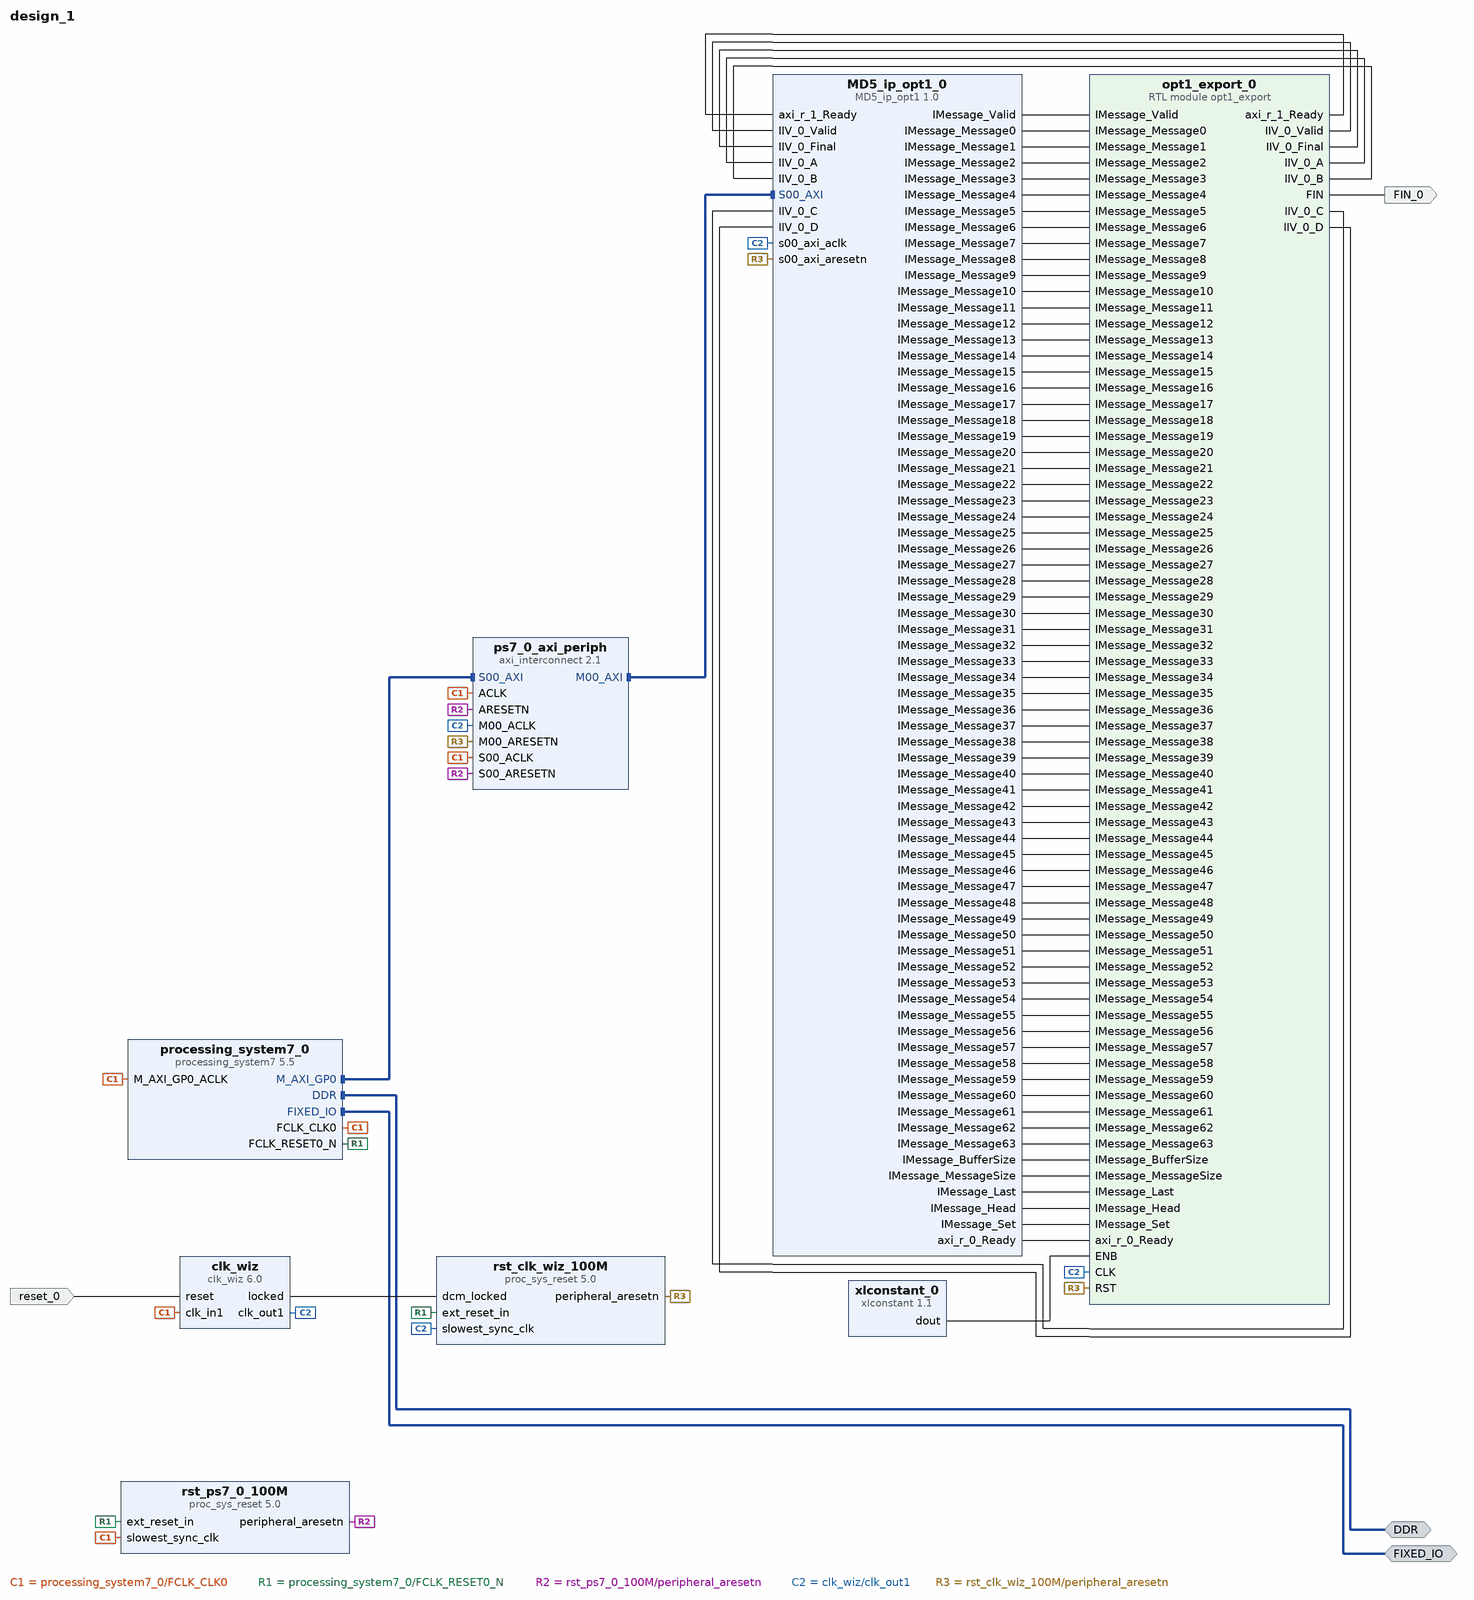
[diagram p0: block diagram of the top level]
# Vivado block design design_1, xc7z020clg484-1, Vivado 2020.2
create_bd_design design_1

create_bd_intf_port -mode Master -vlnv xilinx.com:interface:ddrx_rtl:1.0 DDR
create_bd_intf_port -mode Master -vlnv xilinx.com:display_processing_system7:fixedio_rtl:1.0 FIXED_IO
create_bd_port -dir O FIN_0
create_bd_port -dir I -type rst reset_0
set_property -dict {CONFIG.POLARITY ACTIVE_HIGH} [get_bd_ports reset_0]

create_bd_cell -type ip -vlnv user.org:user:MD5_ip_opt1:1.0 MD5_ip_opt1_0
create_bd_cell -type module -reference opt1_export opt1_export_0
create_bd_cell -type ip -vlnv xilinx.com:ip:xlconstant:1.1 xlconstant_0
create_bd_cell -type ip -vlnv xilinx.com:ip:processing_system7:5.5 processing_system7_0
set_property -dict [list \
  CONFIG.PCW_APU_PERIPHERAL_FREQMHZ 666.666667 \
  CONFIG.PCW_ENET0_ENET0_IO {MIO 16 .. 27} \
  CONFIG.PCW_ENET0_GRP_MDIO_ENABLE 1 \
  CONFIG.PCW_ENET0_GRP_MDIO_IO {MIO 52 .. 53} \
  CONFIG.PCW_ENET0_PERIPHERAL_ENABLE 1 \
  CONFIG.PCW_ENET0_RESET_ENABLE 0 \
  CONFIG.PCW_ENET_RESET_ENABLE 1 \
  CONFIG.PCW_ENET_RESET_SELECT {Share reset pin} \
  CONFIG.PCW_FPGA0_PERIPHERAL_FREQMHZ 100.000000 \
  CONFIG.PCW_FPGA1_PERIPHERAL_FREQMHZ 150.000000 \
  CONFIG.PCW_FPGA2_PERIPHERAL_FREQMHZ 50.000000 \
  CONFIG.PCW_GPIO_MIO_GPIO_ENABLE 1 \
  CONFIG.PCW_GPIO_MIO_GPIO_IO MIO \
  CONFIG.PCW_I2C_RESET_ENABLE 1 \
  CONFIG.PCW_PRESET_BANK1_VOLTAGE {LVCMOS 1.8V} \
  CONFIG.PCW_QSPI_GRP_SINGLE_SS_ENABLE 1 \
  CONFIG.PCW_QSPI_GRP_SINGLE_SS_IO {MIO 1 .. 6} \
  CONFIG.PCW_QSPI_PERIPHERAL_ENABLE 1 \
  CONFIG.PCW_QSPI_PERIPHERAL_FREQMHZ 200.000000 \
  CONFIG.PCW_QSPI_QSPI_IO {MIO 1 .. 6} \
  CONFIG.PCW_SD0_GRP_CD_ENABLE 1 \
  CONFIG.PCW_SD0_GRP_CD_IO {MIO 47} \
  CONFIG.PCW_SD0_GRP_WP_ENABLE 1 \
  CONFIG.PCW_SD0_GRP_WP_IO {MIO 46} \
  CONFIG.PCW_SD0_PERIPHERAL_ENABLE 1 \
  CONFIG.PCW_SD0_SD0_IO {MIO 40 .. 45} \
  CONFIG.PCW_SDIO_PERIPHERAL_FREQMHZ 50 \
  CONFIG.PCW_SINGLE_QSPI_DATA_MODE x4 \
  CONFIG.PCW_TTC0_PERIPHERAL_ENABLE 1 \
  CONFIG.PCW_TTC0_TTC0_IO EMIO \
  CONFIG.PCW_UART1_PERIPHERAL_ENABLE 1 \
  CONFIG.PCW_UART1_UART1_IO {MIO 48 .. 49} \
  CONFIG.PCW_UART_PERIPHERAL_FREQMHZ 50 \
  CONFIG.PCW_UIPARAM_DDR_FREQ_MHZ 533.333313 \
  CONFIG.PCW_UIPARAM_DDR_PARTNO {MT41J128M16 HA-15E} \
  CONFIG.PCW_USB0_PERIPHERAL_ENABLE 1 \
  CONFIG.PCW_USB0_RESET_ENABLE 0 \
  CONFIG.PCW_USB0_USB0_IO {MIO 28 .. 39} \
  CONFIG.PCW_USB_RESET_ENABLE 1 \
  CONFIG.PCW_USB_RESET_SELECT {Share reset pin} \
  CONFIG.preset ZedBoard \
] [get_bd_cells processing_system7_0]
# 221 more settings of processing_system7_0 are not shown: defaults, MIO pin electricals, DDR timing, and values the tool derives
create_bd_cell -type ip -vlnv xilinx.com:ip:axi_interconnect:2.1 ps7_0_axi_periph
set_property -dict {CONFIG.NUM_MI 1} [get_bd_cells ps7_0_axi_periph]
create_bd_cell -type ip -vlnv xilinx.com:ip:clk_wiz:6.0 clk_wiz
set_property -dict [list \
  CONFIG.CLKOUT1_JITTER 358.628 \
  CONFIG.CLKOUT1_PHASE_ERROR 293.793 \
  CONFIG.CLKOUT1_REQUESTED_OUT_FREQ 9.5 \
  CONFIG.MMCM_CLKFBOUT_MULT_F 49.875 \
  CONFIG.MMCM_CLKOUT0_DIVIDE_F 105.000 \
  CONFIG.MMCM_DIVCLK_DIVIDE 5 \
] [get_bd_cells clk_wiz]
create_bd_cell -type ip -vlnv xilinx.com:ip:proc_sys_reset:5.0 rst_ps7_0_100M
create_bd_cell -type ip -vlnv xilinx.com:ip:proc_sys_reset:5.0 rst_clk_wiz_100M

# ---- connections ----

connect_bd_intf_net [get_bd_intf_pins ps7_0_axi_periph/M00_AXI] [get_bd_intf_pins MD5_ip_opt1_0/S00_AXI]
connect_bd_intf_net [get_bd_intf_ports DDR] [get_bd_intf_pins processing_system7_0/DDR]
connect_bd_intf_net [get_bd_intf_ports FIXED_IO] [get_bd_intf_pins processing_system7_0/FIXED_IO]
connect_bd_intf_net [get_bd_intf_pins processing_system7_0/M_AXI_GP0] [get_bd_intf_pins ps7_0_axi_periph/S00_AXI]
connect_bd_net [get_bd_pins MD5_ip_opt1_0/IMessage_Valid] [get_bd_pins opt1_export_0/IMessage_Valid]
connect_bd_net [get_bd_pins MD5_ip_opt1_0/IMessage_Message0] [get_bd_pins opt1_export_0/IMessage_Message0]
connect_bd_net [get_bd_pins MD5_ip_opt1_0/IMessage_Message1] [get_bd_pins opt1_export_0/IMessage_Message1]
connect_bd_net [get_bd_pins MD5_ip_opt1_0/IMessage_Message2] [get_bd_pins opt1_export_0/IMessage_Message2]
connect_bd_net [get_bd_pins MD5_ip_opt1_0/IMessage_Message3] [get_bd_pins opt1_export_0/IMessage_Message3]
connect_bd_net [get_bd_pins MD5_ip_opt1_0/IMessage_Message4] [get_bd_pins opt1_export_0/IMessage_Message4]
connect_bd_net [get_bd_pins MD5_ip_opt1_0/IMessage_Message5] [get_bd_pins opt1_export_0/IMessage_Message5]
connect_bd_net [get_bd_pins MD5_ip_opt1_0/IMessage_Message6] [get_bd_pins opt1_export_0/IMessage_Message6]
connect_bd_net [get_bd_pins MD5_ip_opt1_0/IMessage_Message7] [get_bd_pins opt1_export_0/IMessage_Message7]
connect_bd_net [get_bd_pins MD5_ip_opt1_0/IMessage_Message8] [get_bd_pins opt1_export_0/IMessage_Message8]
connect_bd_net [get_bd_pins MD5_ip_opt1_0/IMessage_Message9] [get_bd_pins opt1_export_0/IMessage_Message9]
connect_bd_net [get_bd_pins MD5_ip_opt1_0/IMessage_Message10] [get_bd_pins opt1_export_0/IMessage_Message10]
connect_bd_net [get_bd_pins MD5_ip_opt1_0/IMessage_Message11] [get_bd_pins opt1_export_0/IMessage_Message11]
connect_bd_net [get_bd_pins MD5_ip_opt1_0/IMessage_Message12] [get_bd_pins opt1_export_0/IMessage_Message12]
connect_bd_net [get_bd_pins MD5_ip_opt1_0/IMessage_Message13] [get_bd_pins opt1_export_0/IMessage_Message13]
connect_bd_net [get_bd_pins MD5_ip_opt1_0/IMessage_Message14] [get_bd_pins opt1_export_0/IMessage_Message14]
connect_bd_net [get_bd_pins MD5_ip_opt1_0/IMessage_Message15] [get_bd_pins opt1_export_0/IMessage_Message15]
connect_bd_net [get_bd_pins MD5_ip_opt1_0/IMessage_Message16] [get_bd_pins opt1_export_0/IMessage_Message16]
connect_bd_net [get_bd_pins MD5_ip_opt1_0/IMessage_Message17] [get_bd_pins opt1_export_0/IMessage_Message17]
connect_bd_net [get_bd_pins MD5_ip_opt1_0/IMessage_Message18] [get_bd_pins opt1_export_0/IMessage_Message18]
connect_bd_net [get_bd_pins MD5_ip_opt1_0/IMessage_Message19] [get_bd_pins opt1_export_0/IMessage_Message19]
connect_bd_net [get_bd_pins MD5_ip_opt1_0/IMessage_Message20] [get_bd_pins opt1_export_0/IMessage_Message20]
connect_bd_net [get_bd_pins MD5_ip_opt1_0/IMessage_Message21] [get_bd_pins opt1_export_0/IMessage_Message21]
connect_bd_net [get_bd_pins MD5_ip_opt1_0/IMessage_Message22] [get_bd_pins opt1_export_0/IMessage_Message22]
connect_bd_net [get_bd_pins MD5_ip_opt1_0/IMessage_Message23] [get_bd_pins opt1_export_0/IMessage_Message23]
connect_bd_net [get_bd_pins MD5_ip_opt1_0/IMessage_Message24] [get_bd_pins opt1_export_0/IMessage_Message24]
connect_bd_net [get_bd_pins MD5_ip_opt1_0/IMessage_Message25] [get_bd_pins opt1_export_0/IMessage_Message25]
connect_bd_net [get_bd_pins MD5_ip_opt1_0/IMessage_Message26] [get_bd_pins opt1_export_0/IMessage_Message26]
connect_bd_net [get_bd_pins MD5_ip_opt1_0/IMessage_Message27] [get_bd_pins opt1_export_0/IMessage_Message27]
connect_bd_net [get_bd_pins MD5_ip_opt1_0/IMessage_Message28] [get_bd_pins opt1_export_0/IMessage_Message28]
connect_bd_net [get_bd_pins MD5_ip_opt1_0/IMessage_Message29] [get_bd_pins opt1_export_0/IMessage_Message29]
connect_bd_net [get_bd_pins MD5_ip_opt1_0/IMessage_Message30] [get_bd_pins opt1_export_0/IMessage_Message30]
connect_bd_net [get_bd_pins MD5_ip_opt1_0/IMessage_Message31] [get_bd_pins opt1_export_0/IMessage_Message31]
connect_bd_net [get_bd_pins MD5_ip_opt1_0/IMessage_Message32] [get_bd_pins opt1_export_0/IMessage_Message32]
connect_bd_net [get_bd_pins MD5_ip_opt1_0/IMessage_Message33] [get_bd_pins opt1_export_0/IMessage_Message33]
connect_bd_net [get_bd_pins MD5_ip_opt1_0/IMessage_Message34] [get_bd_pins opt1_export_0/IMessage_Message34]
connect_bd_net [get_bd_pins MD5_ip_opt1_0/IMessage_Message35] [get_bd_pins opt1_export_0/IMessage_Message35]
connect_bd_net [get_bd_pins MD5_ip_opt1_0/IMessage_Message36] [get_bd_pins opt1_export_0/IMessage_Message36]
connect_bd_net [get_bd_pins MD5_ip_opt1_0/IMessage_Message37] [get_bd_pins opt1_export_0/IMessage_Message37]
connect_bd_net [get_bd_pins MD5_ip_opt1_0/IMessage_Message38] [get_bd_pins opt1_export_0/IMessage_Message38]
connect_bd_net [get_bd_pins MD5_ip_opt1_0/IMessage_Message39] [get_bd_pins opt1_export_0/IMessage_Message39]
connect_bd_net [get_bd_pins MD5_ip_opt1_0/IMessage_Message40] [get_bd_pins opt1_export_0/IMessage_Message40]
connect_bd_net [get_bd_pins MD5_ip_opt1_0/IMessage_Message41] [get_bd_pins opt1_export_0/IMessage_Message41]
connect_bd_net [get_bd_pins MD5_ip_opt1_0/IMessage_Message42] [get_bd_pins opt1_export_0/IMessage_Message42]
connect_bd_net [get_bd_pins MD5_ip_opt1_0/IMessage_Message43] [get_bd_pins opt1_export_0/IMessage_Message43]
connect_bd_net [get_bd_pins MD5_ip_opt1_0/IMessage_Message44] [get_bd_pins opt1_export_0/IMessage_Message44]
connect_bd_net [get_bd_pins MD5_ip_opt1_0/IMessage_Message45] [get_bd_pins opt1_export_0/IMessage_Message45]
connect_bd_net [get_bd_pins MD5_ip_opt1_0/IMessage_Message46] [get_bd_pins opt1_export_0/IMessage_Message46]
connect_bd_net [get_bd_pins MD5_ip_opt1_0/IMessage_Message47] [get_bd_pins opt1_export_0/IMessage_Message47]
connect_bd_net [get_bd_pins MD5_ip_opt1_0/IMessage_Message48] [get_bd_pins opt1_export_0/IMessage_Message48]
connect_bd_net [get_bd_pins MD5_ip_opt1_0/IMessage_Message49] [get_bd_pins opt1_export_0/IMessage_Message49]
connect_bd_net [get_bd_pins MD5_ip_opt1_0/IMessage_Message50] [get_bd_pins opt1_export_0/IMessage_Message50]
connect_bd_net [get_bd_pins MD5_ip_opt1_0/IMessage_Message51] [get_bd_pins opt1_export_0/IMessage_Message51]
connect_bd_net [get_bd_pins MD5_ip_opt1_0/IMessage_Message52] [get_bd_pins opt1_export_0/IMessage_Message52]
connect_bd_net [get_bd_pins MD5_ip_opt1_0/IMessage_Message53] [get_bd_pins opt1_export_0/IMessage_Message53]
connect_bd_net [get_bd_pins MD5_ip_opt1_0/IMessage_Message54] [get_bd_pins opt1_export_0/IMessage_Message54]
connect_bd_net [get_bd_pins MD5_ip_opt1_0/IMessage_Message55] [get_bd_pins opt1_export_0/IMessage_Message55]
connect_bd_net [get_bd_pins MD5_ip_opt1_0/IMessage_Message56] [get_bd_pins opt1_export_0/IMessage_Message56]
connect_bd_net [get_bd_pins MD5_ip_opt1_0/IMessage_Message57] [get_bd_pins opt1_export_0/IMessage_Message57]
connect_bd_net [get_bd_pins MD5_ip_opt1_0/IMessage_Message58] [get_bd_pins opt1_export_0/IMessage_Message58]
connect_bd_net [get_bd_pins MD5_ip_opt1_0/IMessage_Message59] [get_bd_pins opt1_export_0/IMessage_Message59]
connect_bd_net [get_bd_pins MD5_ip_opt1_0/IMessage_Message60] [get_bd_pins opt1_export_0/IMessage_Message60]
connect_bd_net [get_bd_pins MD5_ip_opt1_0/IMessage_Message61] [get_bd_pins opt1_export_0/IMessage_Message61]
connect_bd_net [get_bd_pins MD5_ip_opt1_0/IMessage_Message62] [get_bd_pins opt1_export_0/IMessage_Message62]
connect_bd_net [get_bd_pins MD5_ip_opt1_0/IMessage_Message63] [get_bd_pins opt1_export_0/IMessage_Message63]
connect_bd_net [get_bd_pins MD5_ip_opt1_0/IMessage_BufferSize] [get_bd_pins opt1_export_0/IMessage_BufferSize]
connect_bd_net [get_bd_pins MD5_ip_opt1_0/IMessage_MessageSize] [get_bd_pins opt1_export_0/IMessage_MessageSize]
connect_bd_net [get_bd_pins MD5_ip_opt1_0/IMessage_Last] [get_bd_pins opt1_export_0/IMessage_Last]
connect_bd_net [get_bd_pins MD5_ip_opt1_0/IMessage_Head] [get_bd_pins opt1_export_0/IMessage_Head]
connect_bd_net [get_bd_pins MD5_ip_opt1_0/IMessage_Set] [get_bd_pins opt1_export_0/IMessage_Set]
connect_bd_net [get_bd_pins MD5_ip_opt1_0/axi_r_0_Ready] [get_bd_pins opt1_export_0/axi_r_0_Ready]
connect_bd_net [get_bd_pins opt1_export_0/axi_r_1_Ready] [get_bd_pins MD5_ip_opt1_0/axi_r_1_Ready]
connect_bd_net [get_bd_pins opt1_export_0/IIV_0_Valid] [get_bd_pins MD5_ip_opt1_0/IIV_0_Valid]
connect_bd_net [get_bd_pins opt1_export_0/IIV_0_Final] [get_bd_pins MD5_ip_opt1_0/IIV_0_Final]
connect_bd_net [get_bd_pins opt1_export_0/IIV_0_A] [get_bd_pins MD5_ip_opt1_0/IIV_0_A]
connect_bd_net [get_bd_pins opt1_export_0/IIV_0_B] [get_bd_pins MD5_ip_opt1_0/IIV_0_B]
connect_bd_net [get_bd_pins opt1_export_0/IIV_0_C] [get_bd_pins MD5_ip_opt1_0/IIV_0_C]
connect_bd_net [get_bd_pins opt1_export_0/IIV_0_D] [get_bd_pins MD5_ip_opt1_0/IIV_0_D]
connect_bd_net [get_bd_pins opt1_export_0/FIN] [get_bd_ports FIN_0]
connect_bd_net [get_bd_pins xlconstant_0/dout] [get_bd_pins opt1_export_0/ENB]
connect_bd_net [get_bd_pins processing_system7_0/FCLK_CLK0] \
  [get_bd_pins processing_system7_0/M_AXI_GP0_ACLK] [get_bd_pins ps7_0_axi_periph/S00_ACLK] \
  [get_bd_pins rst_ps7_0_100M/slowest_sync_clk] [get_bd_pins ps7_0_axi_periph/ACLK] [get_bd_pins clk_wiz/clk_in1]
connect_bd_net [get_bd_pins processing_system7_0/FCLK_RESET0_N] [get_bd_pins rst_ps7_0_100M/ext_reset_in] [get_bd_pins rst_clk_wiz_100M/ext_reset_in]
connect_bd_net [get_bd_pins rst_ps7_0_100M/peripheral_aresetn] [get_bd_pins ps7_0_axi_periph/S00_ARESETN] [get_bd_pins ps7_0_axi_periph/ARESETN]
connect_bd_net [get_bd_pins clk_wiz/clk_out1] \
  [get_bd_pins MD5_ip_opt1_0/s00_axi_aclk] [get_bd_pins ps7_0_axi_periph/M00_ACLK] \
  [get_bd_pins rst_clk_wiz_100M/slowest_sync_clk] [get_bd_pins opt1_export_0/CLK]
connect_bd_net [get_bd_pins clk_wiz/locked] [get_bd_pins rst_clk_wiz_100M/dcm_locked]
connect_bd_net [get_bd_pins rst_clk_wiz_100M/peripheral_aresetn] \
  [get_bd_pins MD5_ip_opt1_0/s00_axi_aresetn] [get_bd_pins ps7_0_axi_periph/M00_ARESETN] [get_bd_pins opt1_export_0/RST]
connect_bd_net -net reset_0_1 [get_bd_ports reset_0] [get_bd_pins clk_wiz/reset]

# ---- address map ----
assign_bd_address -offset 0x43C00000 -range 64K -target_address_space [get_bd_addr_spaces processing_system7_0/Data] [get_bd_addr_segs MD5_ip_opt1_0/S00_AXI/S00_AXI_reg]

validate_bd_design
save_bd_design
